# EAGLE design TouScruino-avr-v0 (EAGLE 6.3)
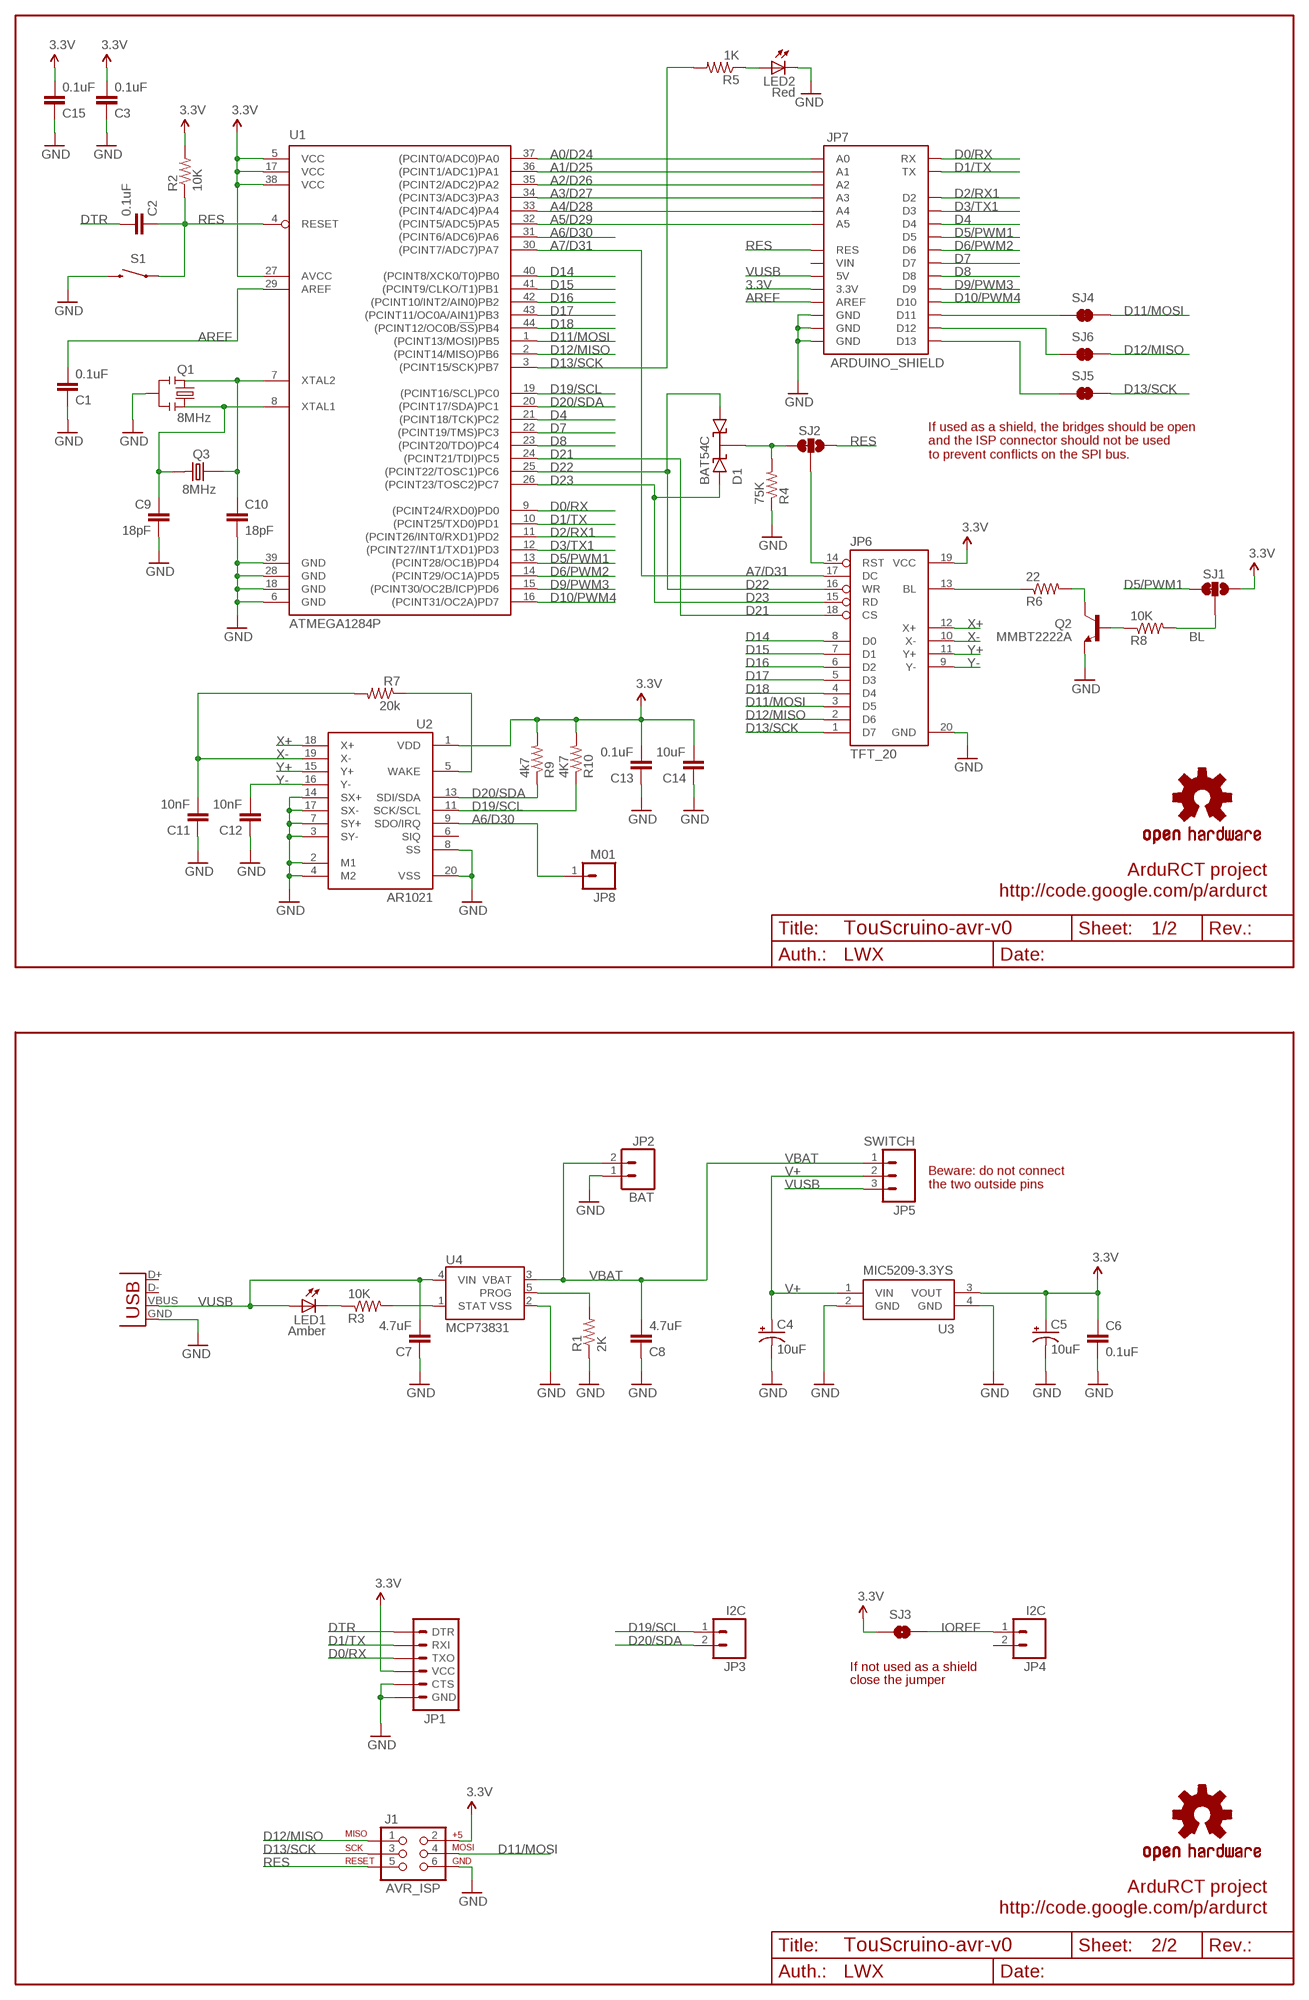
[diagram p0: schematic, sheet 1]

## Parts
C1  0.1uF  CAP0805  [0805]
C2  0.1uF  CAP0805  [0805]
C3  0.1uF  CAP0805  [0805]
C4  10uF  CAP_POL1206  [EIA3216]
C5  10uF  CAP_POL1206  [EIA3216]
C6  0.1uF  CAP0805  [0805]
C7  4.7uF  CAP0805  [0805]
C8  4.7uF  CAP0805  [0805]
C9  18pF  CAP0603-CAP  [0603-CAP]
C10  18pF  CAP0603-CAP  [0603-CAP]
C11  10nF  CAP0805  [0805]
C12  10nF  CAP0805  [0805]
C13  0.1uF  CAP0805  [0805]
C14  10uF  CAP0805  [0805]
C15  0.1uF  CAP0805  [0805]
D1  BAT54C  [SOT23-3]
J1  AVR_ISP  AVR_SPI_PRG_6PTH  [2X3]
JP1  ARDUINO_SERIAL_PROGRAMPTH  [1X06]
JP2  BAT  M02-JST-2MM-SMT  [JST-2-SMD]
JP3  I2C  M02  [1X02]
JP4  I2C  M02  [1X02]
JP5  SWITCH  M03  [1X3_LONGPAD]
JP6  TFT_20  [TFT_20]
JP7  ARDUINO_SHIELD  [ARDUINO_SHIELD]
JP8  M01  [1X1]
LED1  Amber  LED  [LED]
LED2  Red  LED  [LED]
Q1  8MHz  RESONATORSMD  [RESONATOR-SMD]
Q2  MMBT2222A  TRANSISTOR_NPNSOT23-3  [SOT23-3]
Q3  8MHz  CRYSTAL_5X3.2  [CRYSTAL_5X3.2]
R1  2K  RESISTOR0805-RES  [0805]
R2  10K  RESISTOR0805-RES  [0805]
R3  10K  RESISTOR0805-RES  [0805]
R4  75K  RESISTOR0805-RES  [0805]
R5  1K  RESISTOR0805-RES  [0805]
R6  22  RESISTOR0805-RES  [0805]
R7  20k  RESISTOR0805-RES  [0805]
R8  10K  RESISTOR0805-RES  [0805]
R9  4k7  RESISTOR0805-RES  [0805]
R10  4K7  RESISTOR0805-RES  [0805]
S1  SWITCH-MOMENTARY-2SMD  [TACTILE_SWITCH_SMD]
SJ1  SJ_2WAYS_1-2  [SJ_2WAYS_1-2_S]
SJ2  SJ_2WAYS_1-2  [SJ_2WAYS_1-2_S]
SJ3  SOLDERJUMPERNO  [SJ_2S-NO]
SJ4  SOLDERJUMPERTRACE  [SJ_2S-TRACE]
SJ5  SOLDERJUMPERTRACE  [SJ_2S-TRACE]
SJ6  SOLDERJUMPERTRACE  [SJ_2S-TRACE]
U1  ATMEGA1284P  ATMEGA324A  [TQFP44]
U2  AR1021  AR1020  [SSOP20]
U3  MIC5209-3.3YS  MIC5209  [SOT223]
U4  MCP73831  [SOT23-5]
U$3  OSHW-LOGOM  [OSHW-LOGO-M]
U$5  OSHW-LOGOM  [OSHW-LOGO-M]
X2  USB-MICROB  [USB-MICROB]

## Nets
3.3V: C3.2 C5.A(+) C6.1 C13.2 C14.2 C15.2 J1.2 JP1.4(VCC) JP6.19(VCC) JP7.3.3V R2.2 R9.2 R10.2 SJ1.3 SJ3.1 U1.5(VCC) U1.17(VCC) U1.27(AVCC) U1.38(VCC) U2.1(VDD) U3.3(VOUT)
A0/D24: JP7.A0 U1.37((PCINT0/ADC0)PA0)
A1/D25: JP7.A1 U1.36((PCINT1/ADC1)PA1)
A2/D26: JP7.A2 U1.35((PCINT2/ADC2)PA2)
A3/D27: JP7.A3 U1.34((PCINT3/ADC3)PA3)
A4/D28: JP7.A4 U1.33((PCINT4/ADC4)PA4)
A5/D29: JP7.A5 U1.32((PCINT5/ADC5)PA5)
A6/D30: JP8.1 U1.31((PCINT6/ADC6)PA6) U2.9(SDO/IRQ)
A7/D31: JP6.17(DC) U1.30((PCINT7/ADC7)PA7)
AREF: C1.2 JP7.AREF U1.29(AREF)
BL: R8.2 SJ1.2
D0/RX: JP1.3(TXO) JP7.RX U1.9((PCINT24/RXD0)PD0)
D1/TX: JP1.2(RXI) JP7.TX U1.10((PCINT25/TXD0)PD1)
D2/RX1: JP7.D2 U1.11((PCINT26/INT0/RXD1)PD2)
D3/TX1: JP7.D3 U1.12((PCINT27/INT1/TXD1)PD3)
D4: JP7.D4 U1.21((PCINT18/TCK)PC2)
D5/PWM1: JP7.D5 SJ1.1 U1.13((PCINT28/OC1B)PD4)
D6/PWM2: JP7.D6 U1.14((PCINT29/OC1A)PD5)
D7: JP7.D7 U1.22((PCINT19/TMS)PC3)
D8: JP7.D8 U1.23((PCINT20/TDO)PC4)
D9/PWM3: JP7.D9 U1.15((PCINT30/OC2B/ICP)PD6)
D10/PWM4: JP7.D10 U1.16((PCINT31/OC2A)PD7)
D11/MOSI: J1.4 JP6.3(D5) SJ4.2 U1.1((PCINT13/MOSI)PB5)
D12/MISO: J1.1 JP6.2(D6) SJ6.2 U1.2((PCINT14/MISO)PB6)
D13/SCK: J1.3 JP6.1(D7) R5.2 SJ5.2 U1.3((PCINT15/SCK)PB7)
D14: JP6.8(D0) U1.40((PCINT8/XCK0/T0)PB0)
D15: JP6.7(D1) U1.41((PCINT9/CLKO/T1)PB1)
D16: JP6.6(D2) U1.42((PCINT10/INT2/AIN0)PB2)
D17: JP6.5(D3) U1.43((PCINT11/OC0A/AIN1)PB3)
D18: JP6.4(D4) U1.44((PCINT12/OC0B/!SS!)PB4)
D19/SCL: JP3.1 R10.1 U1.19((PCINT16/SCL)PC0) U2.11(SCK/SCL)
D20/SDA: JP3.2 R9.1 U1.20((PCINT17/SDA)PC1) U2.13(SDI/SDA)
D21: JP6.18(CS) U1.24((PCINT21/TDI)PC5)
D22: D1.1(A1) JP6.16(WR) U1.25((PCINT22/TOSC1)PC6)
D23: D1.2(A2) JP6.15(RD) U1.26((PCINT23/TOSC2)PC7)
DTR: C2.2 JP1.1(DTR)
GND [vcc]: C1.1 C3.1 C4.C(-) C5.C(-) C6.2 C7.1 C8.1 C9.2 C10.2 C11.1 C12.1 C13.1 C14.1 C15.1 J1.6 JP1.5(CTS) JP1.6(GND) JP2.1 JP6.20(GND) JP7.GND@0(GND) JP7.GND@1(GND) JP7.GND@2(GND) LED2.C1(C) Q1.2 Q2.2(E) R1.1 R4.1 S1.3 U1.6(GND) U1.18(GND) U1.28(GND) U1.39(GND) U2.2(M1) U2.3(SY-) U2.4(M2) U2.7(SY+) U2.8(SS) U2.14(SX+) U2.17(SX-) U2.20(VSS) U3.2(GND) U3.4(GND) U4.2(VSS) X2.GND
IOREF: JP4.1 SJ3.2
LCD_RES: JP6.14(RST) SJ2.2
N$1: C9.1 Q1.1 Q3.2 U1.8(XTAL1)
N$2: C10.1 Q1.3 Q3.1 U1.7(XTAL2)
N$3: JP7.D11 SJ4.1
N$4: Q2.1(B) R8.1
N$5: LED2.A1(A) R5.1
N$6: R7.1 U2.5(WAKE)
N$7: Q2.3(C) R6.2
N$8: LED1.C1(C) R3.1
N$9: D1.3(K) R4.2 SJ2.1
N$10: JP7.D13 SJ5.1
N$11: JP6.13(BL) R6.1
N$12: R3.2 U4.1(STAT)
N$13: R1.2 U4.5(PROG)
N$14: JP7.D12 SJ6.1
RES: C2.1 J1.5 JP7.RES R2.1 S1.1 SJ2.3 U1.4(RESET)
V+: C4.A(+) JP5.2 U3.1(VIN)
VBAT: C8.2 JP2.2 JP5.1 U4.3(VBAT)
VUSB: C7.2 JP5.3 JP7.5V LED1.A1(A) U4.4(VIN) X2.VBUS
X+: JP6.12(X+) U2.18(X+)
X-: C11.2 JP6.10(X-) R7.2 U2.19(X-)
Y+: JP6.11(Y+) U2.15(Y+)
Y-: C12.2 JP6.9(Y-) U2.16(Y-)
Unconnected: JP4.2 JP7.VIN U2.6(SIQ) X2.D+ X2.D-

## Notes on the sheet
- If used as a shield, the bridges should be open
  and the ISP connector should not be used
  to prevent conflicts on the SPI bus.
- ArduRCT project
- http://code.google.com/p/ardurct
- 1/2
- LWX
- Beware: do not connect
  the two outside pins
- If not used as a shield
- close the jumper
- ArduRCT project
- http://code.google.com/p/ardurct
- 2/2
- LWX

## Library data of the parts
C1-C3 C6-C15 = SparkFun:CAP: Capacitor Standard 0603 ceramic capacitor, and 0.1" leaded capacitor.
C4 C5 = SparkFun:CAP_POL: Capacitor Polarized These are standard SMD and PTH capacitors. Normally 10uF, 47uF, and 100uF in electrolytic and tantalum varieties. Always verify the external diameter of the through hole cap, it varies with capacity, voltage, and manufacturer. The EIA devices should be standard.
D1 = wibauxl:BAT54C
J1 = SparkFun:AVR_SPI_PRG_6: AVR ISP 6 Pin This is the reduced ISP connector for AVR programming. Common on Arduino. This footprint will take up less PCB space and can be used with a 10-pin to 6-pin adapter such as SKU: BOB-08508
JP1 = SparkFun:ARDUINO_SERIAL_PROGRAM
JP2 = SparkFun:M02: Header 2 Standard 2-pin 0.1" header. Use with straight break away headers (SKU : PRT-00116), right angle break away headers (PRT-00553), swiss pins (PRT-00743), machine pins (PRT-00117), and female headers (PRT-00115). Molex polarized connector foot print use with SKU : PRT-08233 with associated crimp pins and housings.
JP3 JP4 = wibauxl:M02
JP5 = wibauxl:M03
JP6 = wibauxl:TFT_20
JP7 = wibauxl:ARDUINO_SHIELD
JP8 = wibauxl:M01
LED1 LED2 = wibauxl:LED
Q1 = SparkFun:RESONATOR: Resonator Small SMD resonator. This is the itty bitty 10/20MHz resonators with built in caps. CSTCE10M0G55 and CSTCE20M0V53. Footprint has been reviewed closely but hasn't been tested yet.
Q2 = SparkFun:TRANSISTOR_NPN: Transistor NPN BJT configuration in SOT23 package. MMBT2222 is the common NPN we use. Double check BCE configuration again layout.
Q3 = wibauxl:CRYSTAL_5X3.2
R1-R10 = SparkFun:RESISTOR: Resistor Basic schematic elements and footprints for 0603, 1206, and PTH resistors.
S1 = SparkFun:SWITCH-MOMENTARY-2
SJ1 SJ2 = wibauxl:SJ_2WAYS_1-2
SJ3-SJ6 = SparkFun:SOLDERJUMPER: Solder Jumper Standard SMD solder jumper. Used to automate production. Two varients : Normally Open and Normally Closed are the same, but have different paste layers. NC will have a large amount of paste and should jumper during reflow.
U1 = wibauxl:ATMEGA324: 8-bit Microcontroller with 64K Bytes In-System Programmable Flash Source: http://www.atmel.com/dyn/resources/prod_documents/doc2593.pdf
U2 = wibauxl:AR1020
U3 = wibauxl:MIC5209
U4 = SparkFun:MCP73831: Microchip's MCP73831 Miniature single cell, fully integrated Li-Ion, Li-polymer charge management controller http://ww1.microchip.com/downloads/en/DeviceDoc/21984a.pdf
U$3 U$5 = SparkFun:OSHW-LOGO: Open Source Hardware Logo This logo indicates the piece of hardware it is found on incorporates a OSHW license and/or adheres to the definition of open source hardware found here: http://freedomdefined.org/OSHW
X2 = SparkFun:USB: USB Connectors USB-B-PTH is fully proven SKU : PRT-00139 USB-miniB is fully proven SKU : PRT-00587 USB-A-PCB is untested. USB-A-H is throughly reviewed, but untested. Spark Fun Electronics SKU : PRT-00437 USB-B-SMT is throughly reviewed, but untested. Needs silkscreen touching up. USB-A-S has not been used/tested USB-MB-H has not been used/tested

## Net classes
0 default: width 0.203 mm
1 vcc: width 0.254 mm

## Board
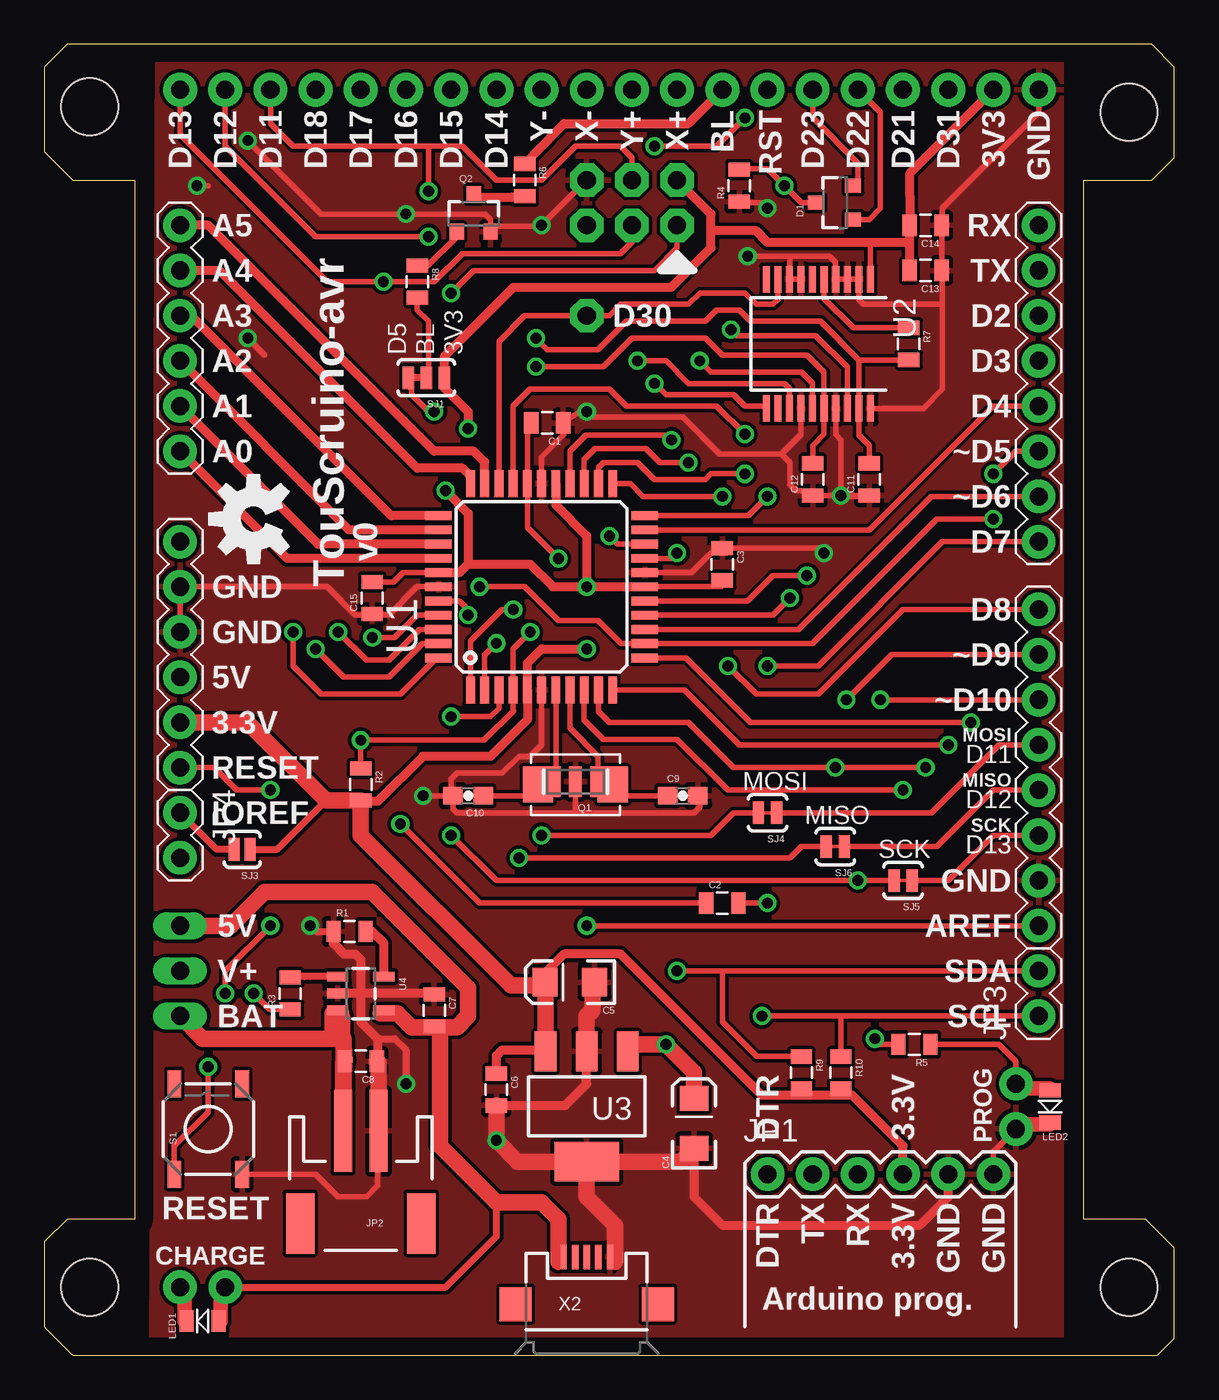
[diagram p1: board, top side]
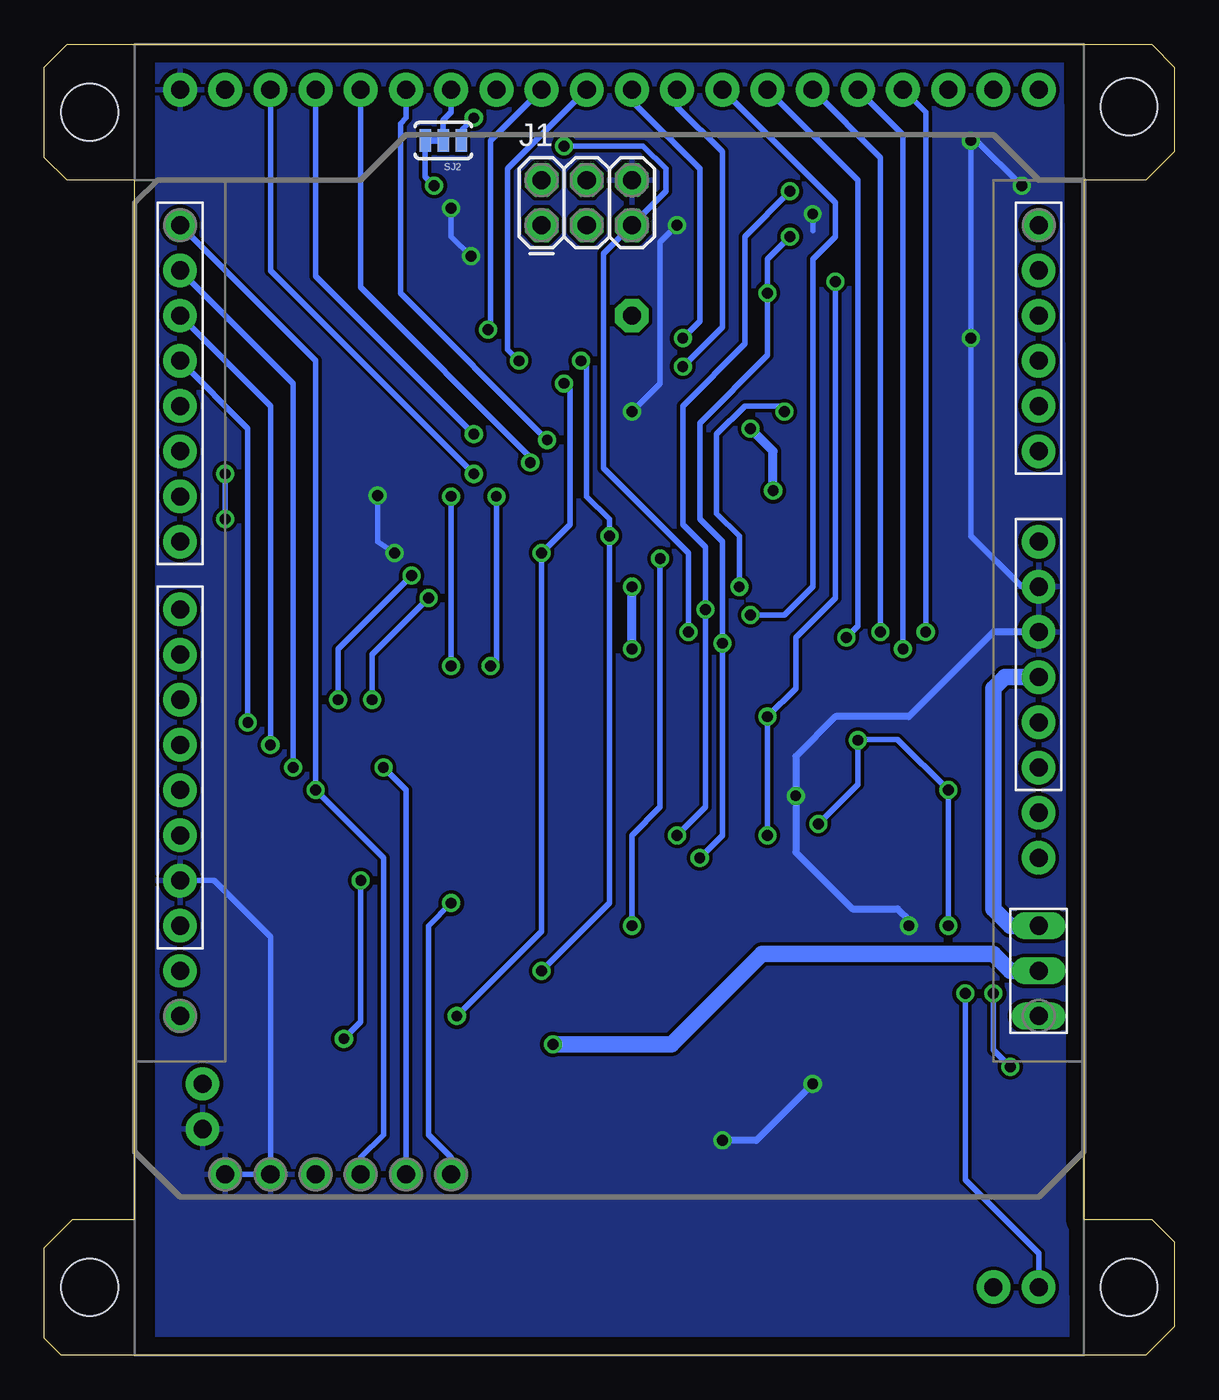
[diagram p2: board, bottom side, seen from below]

Size 63.5 x 73.66 mm. Coordinates in mm from the lower left corner, seen from the top.
Outline: 63.5,0.95 63.5,6.03 61.91,7.62 58.42,7.62 58.42,66.04 62.23,66.04 63.5,67.31 63.5,72.39 62.23,73.66 1.27,73.66 0,72.39 0,67.63 1.59,66.04 1.91,66.04 5.08,66.04 5.08,7.62 1.27,7.62 0,6.35 0,1.59 1.59,0 62.55,0 63.5,0.95
Copper layers (1*16): Top 0.035mm / dielectric 1.5mm / Bottom 0.035mm
Design rules "default": minimum track width 10mil, minimum drill 24mil, track to track 8mil, track to pad 8mil, pad to pad 8mil, via to via 8mil, smd to smd 8mil, copper to edge 40mil, drill to drill 8mil, minimum pad ring 10mil, minimum via ring 8mil, stop-mask expansion 4mil, vias tented up to drill 0mil, thermal gap 10mil
Holes 3.2 mm at 2.54,70.17 60.96,69.85 2.54,3.81 60.96,3.81

### Footprints (pad centres in the part's own frame; a part is rotated, then mirrored left to right if it is on the bottom)
0805 = smd 0.8 x 1.2: 1 -0.9,0; 2 0.9,0
EIA3216 = smd 1.4 x 1.6: A 1.4,0; C -1.4,0
0603-CAP = smd 1.1 x 1: 1 -0.85,0; 2 0.85,0
SOT23-3 = smd 0.8 x 0.9: 1 -0.95,-1; 2 0.95,-1; 3 0,1.1
2X3 = drill 1.016 pad 1.88 octagon: 1 0,0; 2 0,2.54; 3 2.54,0; 4 2.54,2.54; 5 5.08,0; 6 5.08,2.54
1X06 = drill 1.016 pad 1.88: 1 0,0; 2 2.54,0; 3 5.08,0; 4 7.62,0; 5 10.16,0; 6 12.7,0
JST-2-SMD = smd 1 x 4.6: 1 -1,-3.7; 2 1,-3.7 | smd 1.6 x 3.4: NC1 -3.4,1.5; NC2 3.4,1.5
1X02 = drill 1.016 pad 1.88: 1 0,0; 2 2.54,0
1X3_LONGPAD = drill 1.016 pad 1.245 long: 1 0,0; 2 -2.54,0; 3 -5.08,0
TFT_20 = drill 1.016 pad 1.905: 1 0,0; 2 -2.54,0; 3 -5.08,0; 4 -7.62,0; 5 -10.16,0; 6 -12.7,0; 7 -15.24,0; 8 -17.78,0; 9 -20.32,0; 10 -22.86,0; 11 -25.4,0; 12 -27.94,0; 13 -30.48,0; 14 -33.02,0; 15 -35.56,0; 16 -38.1,0; 17 -40.64,0; 18 -43.18,0; 19 -45.72,0; 20 -48.26,0
ARDUINO_SHIELD = drill 1.016 pad 1.88: 3.3V 33.02,50.8; 5V 30.48,50.8; A0 17.78,50.8; A1 15.24,50.8; A2 12.7,50.8; A3 10.16,50.8; A4 7.62,50.8; A5 5.08,50.8; AREF 44.45,2.54; D2 10.16,2.54; D3 12.7,2.54; D4 15.24,2.54; D5 17.78,2.54; D6 20.32,2.54; D7 22.86,2.54; D8 26.67,2.54; D9 29.21,2.54; D10 31.75,2.54; D11 34.29,2.54; D12 36.83,2.54; D13 39.37,2.54; GND@0 27.94,50.8; GND@1 25.4,50.8; GND@2 41.91,2.54; RES 35.56,50.8; RX 5.08,2.54; TX 7.62,2.54; VIN 22.86,50.8
1X1 = drill 1.016 pad 1.88 octagon: 1 0,0
LED = smd 0.8 x 1.2: A -0.9,0; C 0.9,0 | drill 1.016 pad 1.88: A1 -1.27,-1.905; C1 1.27,-1.905
RESONATOR-SMD = smd 0.7 x 1.7: 1 -1.2,0; 2 0,0; 3 1.2,0
CRYSTAL_5X3.2 = smd 1.7 x 2: 1 2.1,0; 2 -2.1,0
TACTILE_SWITCH_SMD = smd 1.524 x 0.762: 1 -2.54,1.905; 2 2.54,1.905; 3 -2.54,-1.905; 4 2.54,-1.905
SJ_2WAYS_1-2_S = smd 0.635 x 1.27: 1 0.508,0; 2 -0.508,0; 3 -1.524,0
SJ_2S-NO = smd 0.635 x 1.27: 1 -0.45,0; 2 0.45,0
SJ_2S-TRACE = smd 0.635 x 1.27: 1 -0.508,0; 2 0.508,0
TQFP44 = smd 1.5 x 0.5: 1 -5.8,4; 2 -5.8,3.2; 3 -5.8,2.4; 4 -5.8,1.6; 5 -5.8,0.8; 6 -5.8,0; 7 -5.8,-0.8; 8 -5.8,-1.6; 9 -5.8,-2.4; 10 -5.8,-3.2; 11 -5.8,-4; 23 5.8,-4; 24 5.8,-3.2; 25 5.8,-2.4; 26 5.8,-1.6; 27 5.8,-0.8; 28 5.8,0; 29 5.8,0.8; 30 5.8,1.6; 31 5.8,2.4; 32 5.8,3.2; 33 5.8,4 | smd 0.5 x 1.5: 12 -4,-5.8; 13 -3.2,-5.8; 14 -2.4,-5.8; 15 -1.6,-5.8; 16 -0.8,-5.8; 17 0,-5.8; 18 0.8,-5.8; 19 1.6,-5.8; 20 2.4,-5.8; 21 3.2,-5.8; 22 4,-5.8; 34 4,5.8; 35 3.2,5.8; 36 2.4,5.8; 37 1.6,5.8; 38 0.8,5.8; 39 0,5.8; 40 -0.8,5.8; 41 -1.6,5.8; 42 -2.4,5.8; 43 -3.2,5.8; 44 -4,5.8
SSOP20 = smd 0.4 x 1.5: 1 -2.925,-3.625; 2 -2.275,-3.625; 3 -1.625,-3.625; 4 -0.975,-3.625; 5 -0.325,-3.625; 6 0.325,-3.625; 7 0.975,-3.625; 8 1.625,-3.625; 9 2.275,-3.625; 10 2.925,-3.625; 11 2.925,3.625; 12 2.275,3.625; 13 1.625,3.625; 14 0.975,3.625; 15 0.325,3.625; 16 -0.325,3.625; 17 -0.975,3.625; 18 -1.625,3.625; 19 -2.275,3.625; 20 -2.925,3.625
SOT223 = smd 1.219 x 2.235: 1 -2.311,-3.099; 2 0,-3.099; 3 2.311,-3.099 | smd 3.6 x 2.2: 4 0,3.099
SOT23-5 = smd 0.55 x 1.2: 1 -0.95,-1.3; 2 0,-1.3; 3 0.95,-1.3; 4 0.95,1.3; 5 -0.95,1.3
USB-MICROB = smd 0.35 x 1.4: D+ 0,2.65; D- -0.65,2.65; GND 1.3,2.65; ID 0.65,2.65; VBUS -1.3,2.65 | smd 1.8 x 1.9: MT1 -4,0; MT2 4,0

### Placement (x,y rotation side)
C1  28.26,52.39 180 top
C2  38.1,25.4 0 top
C3  38.1,44.45 270 top
C4  36.51,13.02 90 top
C5  29.53,20.95 180 top
C6  25.4,14.92 270 top
C7  21.91,19.37 270 top
C8  17.78,16.51 180 top
C9  35.88,31.43 0 top
C10  23.81,31.43 180 top
C11  46.35,49.21 90 top
C12  43.18,49.21 90 top
C13  49.53,60.96 180 top
C14  49.53,63.5 180 top
C15  18.41,42.55 90 top
D1  44.45,64.77 90 top
J1  35.56,63.5 0 bottom
JP1  40.64,10.16 0 top
JP2  17.78,8.89 180 top
JP3  55.88,19.05 90 top
JP4  7.62,30.48 270 top
JP5  7.62,19.05 270 bottom
JP6  7.62,71.12 0 bottom
JP7  58.42,68.58 270 bottom
JP8  30.48,58.42 0 top
LED1  8.89,1.91 180 top
LED2  56.52,13.97 270 top
Q1  29.84,32.23 180 top
Q2  24.13,64.14 0 top
Q3  29.84,32.07 180 top
R1  17.14,23.81 0 top
R2  17.78,32.07 270 top
R3  13.81,20.32 90 top
R4  39.05,65.72 90 top
R5  48.9,17.46 180 top
R6  26.99,66.04 270 top
R7  48.58,56.83 270 top
R8  20.95,60.33 270 top
R9  42.55,15.88 270 top
R10  44.77,15.88 270 top
S1  9.21,12.7 90 top
SJ1  20.95,54.93 180 top
SJ2  41.59,68.26 180 bottom
SJ3  11.11,28.42 180 top
SJ4  40.64,30.48 180 top
SJ5  48.26,26.67 180 top
SJ6  44.45,28.57 180 top
U1  27.94,43.18 90 top
U2  43.5,56.83 180 top
U3  30.48,13.97 180 top
U4  17.78,20.32 270 top
U$3  11.75,46.99 90 top
U$5  11.75,46.99 90 top
X2  30.48,2.86 0 top

### Tracks (layer width: path | path; a pad name or v marks a point on that pad's centre or on a via)
3.3V  (via drill 0.61)
  Top 0.305: U1.17 38.05,43.18 C3.2 | U2.1 46.42,62.48 46.35,62.55 | 44.77,15.24 R10.2 44.77,14.92 45.09,14.61 | R9.2 41.91,14.61 | C15.2 19.63,43.45 20.17,43.98 U1.38
  Top 0.406: SJ3.1 13.07,28.42 15.82,31.17
  Top 0.508: J1.2 37.47,64.14 37.47,63.18 | JP6.19 48.65,66.42 48.65,65.1 C14.2 48.63,62.6 48.58,62.55 | 37.47,63.18 37.47,62.23 35.24,60.01 26.35,60.01 22.48,56.13 SJ1.3 22.48,54.36 22.54,54.93 22.54,54.29 23.81,53.02 v23.81,52.07 | U1.27 28.74,47.78 30.48,46.04 v30.48,43.18 | 23.81,44.45 23.34,43.98 U1.38 | v22.54,48.58 23.81,47.31 23.81,44.45 | 23.81,44.45 27.3,44.45 28.57,43.18 v30.48,43.18 | v30.48,43.18 U1.17 | v30.48,39.69 27.94,39.69 27.14,38.89 U1.5 27.14,35.71 25.08,33.66 21.27,33.66 18.73,31.11 17.83,31.11 R2.2 | 37.47,63.18 40.01,63.18 40.64,62.55 46.35,62.55 48.58,62.55 | JP1.4 48.26,11.75 45.4,14.61 45.09,14.61 41.91,14.61 40.32,14.61 32.38,22.54 29.21,22.54 27.94,21.27 28.26,21.09 C5.A | C6.1 25.4,16.83 25.72,17.14 28.09,17.14 U3.3 | C13.2 48.63,62.49 48.58,62.55
  Top 0.914: JP7.3.3V 11.43,35.56 15.82,31.17 R2.2 17.78,29.21 26.22,20.77 27.94,20.77 C5.A 28.17,20.91 U3.3
  Bottom 0.508: v22.54,48.58 22.54,50.8 v23.81,52.07 | v30.48,39.69 v30.48,43.18
A0/D24
  Top 0.508: U1.37 13.64,44.78 JP7.A0
A1/D25
  Top 0.508: U1.36 15.38,45.58 JP7.A1
A2/D26
  Top 0.508: U1.35 17.12,46.38 JP7.A2
A3/D27
  Top 0.508: U1.34 19.5,47.18 8.26,58.42 JP7.A3
A4/D28
  Top 0.508: U1.33 23.94,49.4 23.5,49.85 20.95,49.85 20.87,49.93 9.84,60.96 JP7.A4
A5/D29
  Top 0.508: U1.32 24.74,50.19 24.13,50.8 21.91,50.8 9.21,63.5 JP7.A5
A6/D30
  Top 0.305: U1.31 25.54,56.97 26.99,58.42 JP8.1 31.75,58.42 32.38,59.05 36.2,59.05 36.83,59.69 39.37,59.69 40.01,59.05 40.96,59.05 41.22,59.32 U2.9
A7/D31  (via drill 0.61)
  Top 0.305: U1.30 26.34,53.33 27.3,54.29 31.75,54.29 32.7,53.34 37.78,53.34 v39.37,51.75
  Bottom 0.305: JP6.17 48.26,60.64 v39.37,51.75
AREF  (via drill 0.61)
  Top 0.305: C1.2 27.14,52.49 U1.29 27.14,46.52 v28.89,44.77 | JP7.AREF v30.48,24.13
  Bottom 0.305: v28.89,44.77 28.89,30.8 30.48,29.21 v30.48,24.13
BL
  Top 0.305: SJ1.2 21.46,55.37 21.59,55.24 21.59,58.1 20.95,58.74 R8.2
D0/RX  (via drill 0.61)
  Top 0.305: U1.9 30.34,35.7 31.43,34.61 35.56,34.61 38.42,31.75 v48.26,31.75
  Bottom 0.305: JP7.RX 48.26,55.88 v48.26,31.75 44.45,27.94 44.45,12.38 45.72,11.11 JP1.3
D1/TX  (via drill 0.61)
  Top 0.305: U1.10 31.14,36.17 31.75,35.56 36.2,35.56 38.73,33.02 v44.45,33.02 v49.53,33.02
  Bottom 0.305: JP7.TX 49.53,54.61 v49.53,33.02 | JP1.2 43.18,31.75 v44.45,33.02
D2/RX1  (via drill 0.61)
  Top 0.305: U1.11 35.96,37.38 39.05,34.29 v50.8,34.29
  Bottom 0.305: JP7.D2 50.8,53.34 v50.8,34.29
D3/TX1  (via drill 0.61)
  Top 0.305: v52.07,35.56 39.69,35.56 36.07,39.18 U1.12
  Bottom 0.305: JP7.D3 52.07,52.07 v52.07,35.56
D4
  Top 0.305: JP7.D4 53.34,53.34 46.38,46.38 U1.21
D5/PWM1  (via drill 0.61)
  Top 0.305: JP7.D5 54.61,50.8 v53.34,49.53 | v53.34,46.99 50.16,46.99 43.16,39.98 U1.13 32.41,39.98 31.11,41.27 28.89,41.27 26.99,43.18 v24.45,43.18 | SJ1.1 20.45,54.48 20.64,54.29 20.64,53.98 21.59,53.02 v21.91,53.02
  Bottom 0.305: v53.34,49.53 v53.34,46.99 | v21.91,53.02 22.23,53.34 24.13,53.34 25.72,51.75 25.72,47.31 24.45,46.04 v24.45,43.18
D6/PWM2
  Top 0.305: JP7.D6 49.85,48.26 42.37,40.78 U1.14
D7  (via drill 0.61)
  Top 0.305: JP7.D7 50.48,45.72 43.5,38.73 v40.64,38.73 | v40.64,48.26 39.56,47.18 U1.22
  Bottom 0.305: v40.64,38.73 v40.64,48.26
D8  (via drill 0.61)
  Top 0.305: JP7.D8 48.26,41.91 43.5,37.15 40.01,37.15 v38.42,38.73 | U1.23 32.94,48.98 33.66,48.26 v38.1,48.26
  Bottom 0.305: v38.42,38.73 38.1,39.05 v38.1,48.26
D9/PWM3  (via drill 0.61)
  Top 0.305: JP7.D9 47.62,39.37 v45.09,36.83 | v41.91,42.55 40.95,41.58 U1.15
  Bottom 0.305: v45.09,36.83 45.09,39.37 v41.91,42.55
D10/PWM4  (via drill 0.61)
  Top 0.305: U1.16 39.52,42.38 40.96,43.81 v42.86,43.81 | v46.99,36.83 JP7.D10
  Bottom 0.305: v42.86,43.81 46.99,39.69 v46.99,36.83
D11/MOSI  (via drill 0.61)
  Top 0.305: J1.4 33.02,67.31 32.38,67.94 29.84,67.94 27.94,66.04 25.4,66.04 23.5,67.94 21.59,67.94 | 21.59,67.94 13.97,67.94 12.7,69.22 JP6.3 | U1.1 23.94,40.13 25.72,41.91 v26.35,41.91 | 21.59,67.94 v21.59,65.41 | v27.94,29.21 37.47,29.21 38.73,30.48 SJ4.2
  Bottom 0.305: v21.59,65.41 24.13,62.87 24.13,56.83 27.62,53.34 27.62,46.67 26.35,45.4 v26.35,41.91 26.35,30.8 v27.94,29.21
D12/MISO  (via drill 0.61)
  Top 0.305: JP6.2 10.16,67.94 15.24,62.87 v21.59,62.87 | v22.86,59.69 24.13,60.96 34.29,60.96 35.56,62.23 J1.1 | U1.2 24.74,39.34 v25.4,40.01 | v26.67,27.94 41.91,27.94 42.55,28.57 SJ6.2
  Bottom 0.305: v21.59,62.87 22.86,61.59 v22.86,59.69 22.86,56.2 26.67,52.39 26.67,46.99 25.4,45.72 v25.4,40.01 25.4,29.21 v26.67,27.94
D13/SCK  (via drill 0.61)
  Top 0.305: J1.3 33.02,62.55 32.38,61.91 23.5,61.91 21.91,60.33 v19.05,60.33 15.88,60.33 7.62,68.58 JP6.1 | U1.3 25.54,36.34 25.08,35.88 v22.86,35.88 | v22.86,29.21 25.4,26.67 v45.72,26.67 SJ5.2 | v46.67,17.78 46.99,17.46 R5.2
  Bottom 0.305: v19.05,60.33 19.05,42.55 21.27,40.32 21.27,37.47 v22.86,35.88 v22.86,29.21 | v45.72,26.67 45.72,18.73 v46.67,17.78
D14  (via drill 0.61)
  Top 0.305: U1.40 23.34,42.38 23.81,41.91 v23.81,41.59
  Bottom 0.305: JP6.8 19.05,64.77 19.05,62.87 20.32,61.59 20.32,43.18 21.91,41.59 v23.81,41.59
D15  (via drill 0.61)
  Top 0.305: U1.41 20.95,41.59 19.68,40.32 18.41,40.32 v18.43,40.34
  Bottom 0.305: JP6.7 17.78,66.04 17.78,40.98 v18.43,40.34
D16  (via drill 0.61)
  Top 0.305: U1.42 21.09,40.78 19.37,39.05 18.1,39.05 v16.51,40.64
  Bottom 0.305: v16.51,40.64 16.51,67.31 JP6.6
D17  (via drill 0.61)
  Top 0.305: U1.43 21.25,39.98 19.37,38.1 16.83,38.1 v15.24,39.69
  Bottom 0.305: v15.24,39.69 15.24,68.58 JP6.5
D18  (via drill 0.61)
  Top 0.305: 22.67,39.18 U1.44 22.04,39.18 20,37.15 15.56,37.15 13.97,38.73 v13.97,40.64
  Bottom 0.305: v13.97,40.64 13.97,69.85 JP6.4
D19/SCL  (via drill 0.61)
  Top 0.305: U1.19 35.57,44.78 v35.56,45.09 | v34.29,54.61 34.92,53.98 38.73,53.98 39.37,53.34 40.44,53.34 U2.11 | v40.32,19.05 44.77,19.05 | 44.77,19.05 JP3.1 | R10.1 44.77,19.05
  Bottom 0.305: v34.29,54.61 33.97,54.29 33.97,46.67 v35.56,45.09 35.56,23.81 v40.32,19.05
D20/SDA  (via drill 0.61)
  Top 0.305: U2.13 41.87,54.33 41.59,54.61 36.2,54.61 34.92,55.88 v33.34,55.88 | U1.20 32.21,45.58 v31.75,46.04 | v35.56,21.59 38.1,21.59 | 38.1,21.59 JP3.2 | R9.1 40.06,16.77 38.1,18.73 38.1,21.59
  Bottom 0.305: v33.34,55.88 33.02,55.56 33.02,48.26 31.75,46.99 v31.75,46.04 31.75,25.4 v35.56,21.59
D21  (via drill 0.61)
  Top 0.305: U1.24 31.14,49.87 31.43,50.16 33.34,50.16 34.29,49.21 37.15,49.21 37.47,49.53 v39.37,49.53
  Bottom 0.305: JP6.18 50.8,60.96 v39.37,49.53
D22  (via drill 0.61)
  Top 0.305: U1.25 30.34,50.34 30.96,50.96 33.81,50.96 34.61,50.16 v36.2,50.16 | D1.1 45.72,63.82 46.35,63.82 46.99,64.45 46.99,69.85 JP6.16
  Bottom 0.305: JP6.16 45.72,60.01 36.2,50.48 v36.2,50.16
D23  (via drill 0.61)
  Top 0.305: U1.26 29.54,50.81 30.43,51.7 34.97,51.7 v35.24,51.44 | 45.72,65.72 45.4,65.72 D1.2 45.72,65.72 | 45.72,65.72 45.72,66.99 43.18,69.53 JP6.15
  Bottom 0.305: JP6.15 43.18,69.53 43.5,69.22 43.5,59.69 v35.24,51.44
DTR  (via drill 0.61)
  Top 0.305: C2.2 v40.64,25.4
  Bottom 0.305: v40.64,25.4 41.91,24.13 41.91,12.38 40.64,11.11 JP1.1
GND  (via drill 0.6, 0.61)
  Top 0.305: J1.6 v27.94,63.5 27.89,63.45 25.35,63.45 25.08,63.18 Q2.2 25.08,63.82 24.77,64.14 v20.32,64.14 15.56,64.14 v11.43,68.26 | U1.28 27.94,50.48 29.21,51.75 29.21,52.65 C1.1 30.43,53.29 v30.48,53.02 30.8,52.7 35.88,52.7 37.94,50.64 41.43,50.64 | U2.7 U2.8 41.91,60.49 41.91,61.75 | v44.77,48.31 C12.1 42.49,48.58 42.23,48.58 41.91,48.9 41.91,50.16 41.43,50.64 | v44.77,48.31 C11.1 | U1.39 20.95,43.18 19.37,41.59 19.05,41.59 | 19.05,41.59 17.46,41.59 15.88,43.18 JP7.GND@1 JP7.GND@0 | U1.18 36.36,43.98 37.47,45.09 38.37,45.09 C3.1 43.76,45.35 v43.81,45.09 | 41.91,61.75 44.13,61.75 44.45,61.44 44.45,60.44 U2.4 U2.3 U2.2 45.77,59.32 46.04,59.05 50.48,59.05 | 50.48,59.05 50.48,60.91 C13.1 C14.1 50.48,63.18 50.48,64.45 55.88,69.85 JP6.20 | U2.20 49.4,53.21 50.48,54.29 50.48,59.05 | U2.14 42.52,51.73 41.43,50.64 | 29.84,30.48 23.18,30.48 22.96,30.7 C10.2 22.86,31.22 22.86,31.43 | 29.84,30.48 36.51,30.48 36.83,30.8 36.83,31.01 C9.2 | Q1.2 29.84,30.48 | U1.6 27.94,34.29 27.3,33.66 26.67,33.66 25.72,32.7 23.18,32.7 22.86,32.38 22.86,31.43 | v44.77,48.31 44.77,51.44 44.47,51.73 U2.17 | R4.1 39.32,64.82 39.37,64.77 40.32,64.77 v40.64,64.45 | v39.53,61.75 41.91,61.75 | X2.GND 31.86,5.51 32.07,5.24 | S1.3 15.24,10.16 16.51,8.89 18.1,8.89 18.73,9.53 18.73,11.27 JP2.1 | v21.27,31.43 22.86,31.43 | v44.77,48.31 44.77,48.26 46.35,48.26 | 12.38,56.2 v11.43,57.15 | 9.21,65.72 v8.57,65.72 | C15.1 19,41.65 19.05,41.59 | 56.52,12.95 54.86,12.95 53.34,11.43 JP1.6
  Top 0.406: v14.92,24.13 15.24,23.81 R1.1 | 18.78,16.41 18.78,17.73 18.73,17.78 19.68,17.78 20.32,17.14 v20.32,15.24
  Top 0.508: C7.1 22.17,20.27 22.23,20.32 17.78,20.32 | 17.78,20.32 U4.2 | R1.1 16.25,23.12 16.83,22.54 17.46,22.54 17.78,22.23 17.78,20.32 | C6.2 29.26,14.02 30.48,15.24 U3.2 | C4.C 36.51,8.89 38.1,7.3 49.21,7.3 50.8,8.89 JP1.5 | 17.78,20.32 17.78,18.73 18.73,17.78 18.73,16.56 C8.1
  Top 0.914: 32.07,5.24 32.07,7.3 30.48,8.89 U3.4 | U3.4 35.77,10.87 C4.C | U3.2 30.48,19.05 30.8,19.37 30.8,20.82 C5.C | U3.4 26.59,10.87 v25.4,12.06 C6.2 | JP2.1 18.78,16.41 C8.1
  Bottom 0.305: v30.48,53.02 28.89,54.61 28.89,62.55 v27.94,63.5 | JP7.GND@2 53.98,26.67 50.8,23.5 JP1.5 JP1.6 | v43.81,45.09 44.77,45.72 v44.77,48.31 | v40.64,64.45 40.64,62.87 v39.53,61.75 | JP7.GND@1 8.57,43.18 11.43,46.04 v11.43,57.15 v11.43,68.26 11.11,68.26 v8.57,65.72 | 20.32,63.18 v20.32,64.14
  Bottom 0.406: JP7.GND@0 10.16,40.64 14.92,35.88 19.05,35.88 21.27,33.66 v21.27,31.43 21.27,28.26 18.1,25.08 15.56,25.08 14.92,24.45 v14.92,24.13 | v20.32,15.24 23.5,12.06 v25.4,12.06
  pour Top: 6.35,73.66 57.15,73.66 57.15,0 6.03,0
  pour Bottom: 6.35,73.66 57.15,73.66 57.15,0 6.03,0
IOREF
  Top 0.406: SJ3.2 9.68,28.42 JP4.1
LCD_RES
  Bottom 0.305: SJ2.2 41.08,69.41 40.64,69.85 JP6.14
N$1
  Top 0.305: C9.1 31.95,31.43 Q3.2 31.79,31.59 Q1.1 31.11,31.66 31.11,33.66 29.54,35.23 U1.8
N$2
  Top 0.305: C10.1 27.43,31.43 Q3.1 27.9,31.59 Q1.3 28.74,31.69 U1.7
N$3
  Top 0.305: JP7.D11 53.66,34.29 49.85,30.48 SJ4.1
N$4
  Top 0.305: R8.1 21.54,61.23 23.18,62.87 Q2.1
N$5
  Top 0.305: R5.1 53.66,17.46 54.61,16.51 LED2.A1
N$6
  Top 0.305: R7.1 45.45,57.73 43.81,59.37 U2.5
N$7
  Top 0.305: 26.3,65.09 R6.2
  Top 0.508: Q2.3 24.13,65.09 26.3,65.09
N$8  (via drill 0.61)
  Top 0.305: R3.1 12.65,19.42 v11.75,20.32
  Bottom 0.305: v11.75,20.32 11.75,9.84 7.62,5.71 LED1.C1
N$9  (via drill 0.61)
  Top 0.305: R4.2 39.1,66.67 40.64,66.67 v41.59,65.72 42.55,64.77 D1.3
  Bottom 0.305: SJ2.1 42.1,66.23 v41.59,65.72
N$10
  Top 0.305: SJ5.1 50.8,26.67 53.34,29.21 JP7.D13
N$11
  Top 0.508: R6.1 28.84,68.84 29.21,69.22 36.2,69.22 JP6.13
N$12
  Top 0.406: U4.1 14.93,21.27 14.61,21.27 13.55,21.27 R3.2
N$13
  Top 0.508: R1.2 18.41,23.81 19.05,23.18 19.05,21.3 U4.5
N$14
  Top 0.305: SJ6.1 50.16,28.57 53.34,31.75 JP7.D12
RES  (via drill 0.61)
  Top 0.305: v34.29,67.94 37.78,67.94 v39.37,69.53 | v27.3,40.64 26.34,39.67 U1.4 26.34,36.21 26.35,36.2 24.71,34.55 v17.78,34.55 R2.1 | C2.1 24.45,25.4 v20,29.84 | JP7.RES 9.53,33.02 10.79,31.75 v12.7,31.75 | v12.7,24.13 10.16,21.59 v10.16,20.32 | v9.21,16.19 9.21,13.65 7.3,11.75 S1.1
  Bottom 0.305: v34.29,67.94 29.84,67.94 28.57,66.67 28.57,65.41 J1.5 32.07,61.91 32.07,49.85 27.3,45.09 v27.3,40.64 | v39.37,69.53 40.01,68.9 40.01,68.01 SJ2.3 | v20,29.84 17.78,32.07 v17.78,34.55 17.73,34.61 15.56,34.61 v12.7,31.75 v12.7,24.13 | v10.16,20.32 10.16,17.14 v9.21,16.19
V+  (via drill 0.61)
  Top 0.914: C4.A 36.51,15.88 v34.92,17.46 33.19,17.46 U3.1
  Bottom 0.914: JP5.2 9.21,21.59 10.16,22.54 23.18,22.54 28.26,17.46 v34.92,17.46
VBAT
  Top 0.305: U4.3 16.48,19.08 16.67,19.21 16.51,18.73
  Top 0.914: 16.51,18.73 16.51,18.41 16.72,17.89 | 16.83,17.46 16.83,17.78 8.89,17.78 JP5.1 | 16.83,17.46 16.83,13.34 16.78,13.29 JP2.2 16.78,16.41 C8.2 16.83,17.46 | 16.83,17.46 16.72,17.89 | 16.72,17.89 16.72,19 16.67,19.21 16.19,19.21 16.19,18.1
VUSB
  Top 0.305: X2.VBUS 29.1,5.51 28.89,5.24 | 20.64,18.41 22.17,18.41 C7.2 22.23,18.1
  Top 0.406: LED1.A1 22.54,3.81 25.4,6.67 25.4,8.57
  Top 0.508: U4.4 19.08,19.34 18.89,19.21
  Top 0.914: 28.89,5.24 28.89,7.62 27.94,8.57 25.4,8.57 22.23,11.75 22.23,18.1 | 18.89,19.21 19.84,19.21 20.64,18.41 23.18,18.41 23.81,19.05 23.81,20.64 18.41,26.04 12.38,26.04 10.48,24.13 JP5.3
  Bottom 0.914: JP7.5V 9.53,38.1 10.16,37.47 10.16,25.08 9.21,24.13 JP5.3
X+  (via drill 0.61)
  Top 0.305: U2.18 45.12,55.52 43.34,57.31 38.89,57.31 v38.58,57.63
  Bottom 0.305: v38.58,57.63 38.42,57.78 38.42,68.26 JP6.12
X-  (via drill 0.61)
  Top 0.305: 45.77,55.93 U2.19 45.77,51.7 46.35,51.12 C11.2 | 48.21,55.88 R7.2 45.77,55.93 | v27.62,57.15 28.26,56.52 31.11,56.52 32.7,58.1 37.15,58.1 37.78,58.74 39.05,58.74 39.69,58.1 43.6,58.1 45.77,55.93
  Bottom 0.305: JP6.10 30.48,70.48 26.67,66.67 26.67,58.1 v27.62,57.15
Y+  (via drill 0.61)
  Top 0.305: v36.83,55.88 37.47,55.24 42.55,55.24 43.17,54.62 U2.15
  Bottom 0.305: JP6.11 37.47,66.67 37.47,56.52 v36.83,55.88
Y-  (via drill 0.61)
  Top 0.305: C12.2 43.18,51.12 43.81,51.75 U2.16 43.81,55.24 42.86,56.2 38.1,56.2 37.15,57.15 33.02,57.15 31.43,55.56 v27.62,55.56
  Bottom 0.305: JP6.9 27.94,70.17 25.4,67.63 25.4,57.78 v27.62,55.56

### Text on the board
tPlace: D13 | D12 | D11 | D18 | D17 | D16 | D15 | D14 | Y- | X- | Y+ | X+ | BL | RST | D23 | D22 | D21 | D31 | 3V3 | GND | RX | A5 | TX | A4 | D2 | A3 | D30 | D3 | D5 | BL | 3V3 | A2 | D4 | A1 | ~D5 | A0 | ~D6 | D7 | v0 | GND | TouScruino-avr | D8 | GND | ~D9 | 5V | ~D10 | 3.3V | MOSI | D11 | MISO | RESET | MOSI | D12 | IOREF | MISO | SCK | D13 | D13 | SCK | GND | AREF | 5V | SDA | V+ | SCL | BAT | PROG | DTR | 3.3V | DTR | TX | RX | 3.3V | GND | GND | RESET | CHARGE | Arduino prog.